# Altium schematic sheet Tiresias_misc.SchDoc: Tiresias Miscellaneous
size 393 x 281 mm; Author: João Victor Colombari Carlet; CompanyName: GMETA; DrawnBy: João Victor Colombari Carlet; Organization: R&D GMETA; Address1: EESC - USP; Address2: 400, Trabalhador São-Carlense Av.; Address3: 13566-590, São Carlos; Address4: São Paulo, Brazil; Revision: 0; SheetNumber: 5; SheetTotal: 5; Address_Website: http://www.sel.eesc.usp.br/jcarmo/metamaterials/
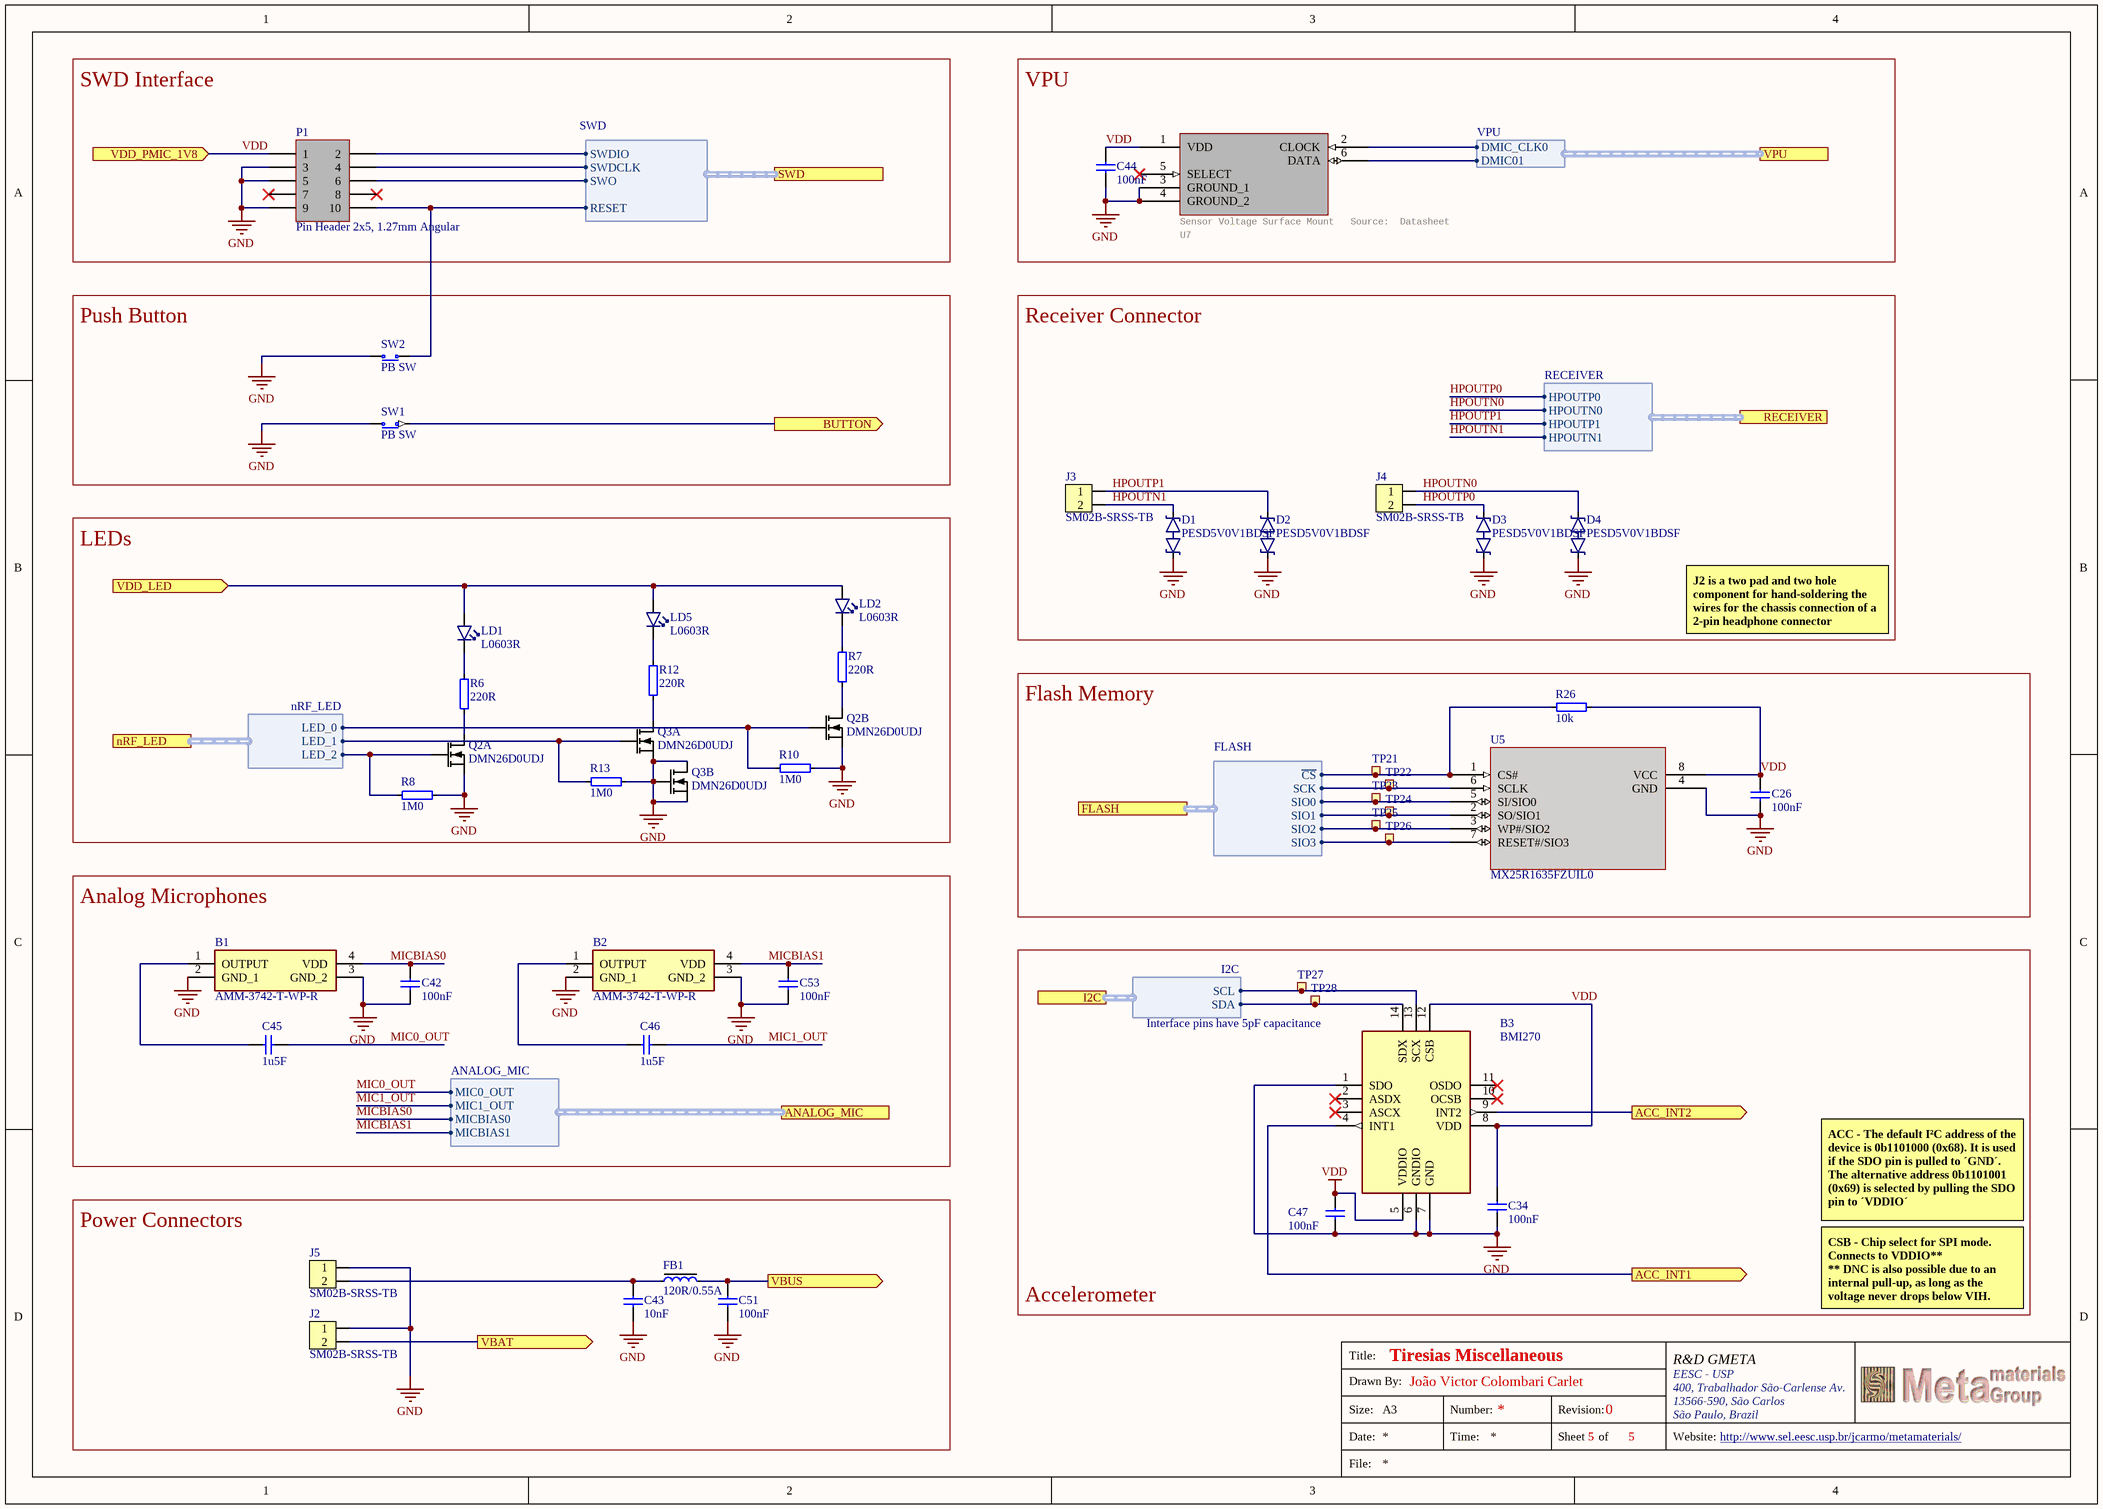
[diagram p0: Tiresias_misc.SchDoc]

## Parts
B1  AMM-3742-T-WP-R  [AMM3742TWPR]
B2  AMM-3742-T-WP-R  [AMM3742TWPR]
B3  BMI270  [BMI270]
C26  100nF  [CAPC0603X03L_C]
C34  100nF  [CAPC0603X03L_C]
C42  100nF  [CAPC0603X03L_C]
C43  10nF  [CAPC0603X03L_C]
C44  100nF  [CAPC0603X03L_C]
C45  1u5F  [CAPC1005X04L]
C46  1u5F  [CAPC1005X04L]
C47  100nF  [CAPC0603X03L_C]
C51  100nF  [CAPC0603X03L_C]
C53  100nF  [CAPC0603X03L_C]
D1  PESD5V0V1BDSF  [DFN40P60X30-2N]
D2  PESD5V0V1BDSF  [DFN40P60X30-2N]
D3  PESD5V0V1BDSF  [DFN40P60X30-2N]
D4  PESD5V0V1BDSF  [DFN40P60X30-2N]
FB1  120R/0.55A  [INDC1005X04L]
J2  SM02B-SRSS-TB  [SM02B-SRSS-TB(LF)(SN)]
J3  SM02B-SRSS-TB  [SM02B-SRSS-TB(LF)(SN)]
J4  SM02B-SRSS-TB  [SM02B-SRSS-TB(LF)(SN)]
J5  SM02B-SRSS-TB  [SM02B-SRSS-TB(LF)(SN)]
LD1  L0603R  [LED_0603_R]
LD2  L0603R  [LED_0603_R]
LD5  L0603R  [LED_0603_R]
P1  Pin Header 2x5, 1.27mm Angular  [HDR_2x5-SMD-1.27mm-ANG]
Q2  DMN26D0UDJ  [SOTFL35P100X50-6N]  (parts A,B of 2)
Q3  DMN26D0UDJ  [SOTFL35P100X50-6N]  (parts A,B of 2)
R6  220R  [RESC0603X03L_C]
R7  220R  [RESC0603X03L_C]
R8  1M0  [RESC0603X03L_C]
R10  1M0  [RESC0603X03L_C]
R12  220R  [RESC0603X03L_C]
R13  1M0  [RESC0603X03L_C]
R26  10k  [RESC0603X03L_C]
SW1  PB SW  [KLS-TS3401]
SW2  PB SW  [KLS-TS3401]
TP21  Ø1.0mm,SMD  [TP_SMD_D1.0mm]  (value not drawn)  (no BOM)
TP22  Ø1.0mm,SMD  [TP_SMD_D1.0mm]  (value not drawn)  (no BOM)
TP23  Ø1.0mm,SMD  [TP_SMD_D1.0mm]  (value not drawn)  (no BOM)
TP24  Ø1.0mm,SMD  [TP_SMD_D1.0mm]  (value not drawn)  (no BOM)
TP25  Ø1.0mm,SMD  [TP_SMD_D1.0mm]  (value not drawn)  (no BOM)
TP26  Ø1.0mm,SMD  [TP_SMD_D1.0mm]  (value not drawn)  (no BOM)
TP27  Ø1.0mm,SMD  [TP_SMD_D1.0mm]  (value not drawn)  (no BOM)
TP28  Ø1.0mm,SMD  [TP_SMD_D1.0mm]  (value not drawn)  (no BOM)
U5  MX25R1635FZUIL0  [USON-8L-2X3X0P6_MAC-L]
U7  Sensor Voltage Surface Mount   Source:  Datasheet  [V2S200D18]

## Blocks framed on the sheet
SWD Interface: P1
VPU: C44 U7
Push Button: SW1 SW2
Receiver Connector: D1-D4 J3 J4
LEDs: LD1 LD2 LD5 Q2 Q3 R6-R8 R10 R12 R13
Flash Memory: C26 R26 TP21-TP26 U5
Analog Microphones: B1 B2 C42 C45 C46 C53
Accelerometer: B3 C34 C47 TP27 TP28
Power Connectors: C43 C51 FB1 J2 J5

## Ports
ACC_INT1 (out, see Tiresias_Cover_letter[4C], Tiresias_MCU[4B]), ACC_INT2 (out, see Tiresias_Cover_letter[4C], Tiresias_MCU[4B]), ANALOG_MIC (harness ANALOG_MIC, see Tiresias_Cover_letter[4C], Tiresias_audio_codec[1D]), BUTTON (out, see Tiresias_Cover_letter[4C], Tiresias_MCU[4A]), FLASH (harness FLASH, see Tiresias_Cover_letter[4C], Tiresias_MCU[4C]), I2C (harness I2C, see Tiresias_Cover_letter[4C], Tiresias_audio_codec[3C], Tiresias_MCU[4C]), nRF_LED (harness nRF_LED, see Tiresias_Cover_letter[4C], Tiresias_MCU[4A]), RECEIVER (harness RECEIVER, see Tiresias_Cover_letter[4C], Tiresias_audio_codec[1D]), SWD (harness SWD, see Tiresias_Cover_letter[4C], Tiresias_MCU[4C]), VBAT (out, see Tiresias_Cover_letter[4B], Tiresias_PMIC[1A]), VBUS (out, see Tiresias_Cover_letter[4B], Tiresias_PMIC[1A]), VDD_LED (in, see Tiresias_Cover_letter[4B], Tiresias_PMIC[3A]), VDD_PMIC_1V8 (in, see Tiresias_Cover_letter[4B], Tiresias_MCU[1A]), VPU (harness VPU, see Tiresias_Cover_letter[4D], Tiresias_audio_codec[1C])

## Harnesses
FLASH: ~{CS}, SCK, SIO0, SIO1, SIO2, SIO3
SWD: SWDIO, SWDCLK, SWO, RESET
ANALOG_MIC: MIC0_OUT, MIC1_OUT, MICBIAS0, MICBIAS1
RECEIVER: HPOUTP0, HPOUTN0, HPOUTP1, HPOUTN1
nRF_LED: LED_0, LED_1, LED_2
I2C: SDA, SCL
VPU: DMIC01, DMIC_CLK0

## Nets
GND: B1.2(GND_1) B1.3(GND_2) B2.2(GND_1) B2.3(GND_2) B3.1(SDO) B3.6(GNDIO) B3.7(GND) C26.1 C34.1 C42.1 C43.1 C44.2 C47.1 C51.1 C53.1 D1.1 D2.1 D3.1 D4.1 J2.1 J5.1 P1.3 P1.5 P1.9 Q2.1(S1) Q2.4(S2) Q3.1(S1) Q3.3(D2) Q3.4(S2) Q3.5(G2) R8.1 R10.1 R13.1 SW1.2(COM) SW2.2(COM) U5.4(GND) U7.3(GROUND_1) U7.4(GROUND_2)
VDD: B3.5(VDDIO) B3.8(VDD) B3.12(CSB) C26.2 C34.2 C44.1 C47.2 P1.1 R26.1 U5.8(VCC) U7.1(VDD) ; port VDD_PMIC_1V8
ACC_INT1: B3.4(INT1) ; port ACC_INT1
ACC_INT2: B3.9(INT2) ; port ACC_INT2
BUTTON: SW1.1(N.O) ; port BUTTON
HPOUTN0: D4.2 J4.1 ; port RECEIVER.HPOUTN0
HPOUTN1: D1.2 J3.2 ; port RECEIVER.HPOUTN1
HPOUTP0: D3.2 J4.2 ; port RECEIVER.HPOUTP0
HPOUTP1: D2.2 J3.1 ; port RECEIVER.HPOUTP1
MIC0_OUT: C45.2 ; port ANALOG_MIC.MIC0_OUT
MIC1_OUT: C46.2 ; port ANALOG_MIC.MIC1_OUT
MICBIAS0: B1.4(VDD) C42.2 ; port ANALOG_MIC.MICBIAS0
MICBIAS1: B2.4(VDD) C53.2 ; port ANALOG_MIC.MICBIAS1
VBAT: J2.2 ; port VBAT
VBUS: C51.2 FB1.2 ; port VBUS
VDD_LED: LD1.2(A) LD2.2(A) LD5.2(A) ; port VDD_LED
NetB1_1: B1.1(OUTPUT) C45.1
NetB2_1: B2.1(OUTPUT) C46.1
NetB3_13: B3.13(SCX) TP27.1 ; port I2C.SCL
NetB3_14: B3.14(SDX) TP28.1 ; port I2C.SDA
NetC43_2: C43.2 FB1.1 J5.2
NetLD1_1: LD1.1(C) R6.2
NetLD2_1: LD2.1(C) R7.2
NetLD5_1: LD5.1(C) R12.2
NetP1_2: P1.2 ; port SWD.SWDIO
NetP1_4: P1.4 ; port SWD.SWDCLK
NetP1_6: P1.6 ; port SWD.SWO
NetP1_10: P1.10 SW2.1(N.O) ; port SWD.RESET
NetQ2_2: Q2.2(G1) R8.2 ; port nRF_LED.LED_2
NetQ2_3: Q2.3(D2) R7.1
NetQ2_5: Q2.5(G2) R10.2 ; port nRF_LED.LED_0
NetQ2_6: Q2.6(D1) R6.1
NetQ3_2: Q3.2(G1) R13.2 ; port nRF_LED.LED_1
NetQ3_6: Q3.6(D1) R12.1
NetR26_2: R26.2 TP21.1 U5.1(CS#) ; port FLASH.~{CS}
NetTP22_1: TP22.1 U5.6(SCLK) ; port FLASH.SCK
NetTP23_1: TP23.1 U5.5(SI/SIO0) ; port FLASH.SIO0
NetTP24_1: TP24.1 U5.2(SO/SIO1) ; port FLASH.SIO1
NetTP25_1: TP25.1 U5.3(WP#/SIO2) ; port FLASH.SIO2
NetTP26_1: TP26.1 U5.7(RESET#/SIO3) ; port FLASH.SIO3
NetU7_2: U7.2(CLOCK) ; port VPU.DMIC_CLK0
NetU7_6: U7.6(DATA) ; port VPU.DMIC01

Not connected (* = marked no-connect by the designer): B3 2(ASDX)* 3(ASCX)* 10(OCSB)* 11(OSDO)*; P1 7* 8*; U7 5(SELECT)*

## Notes on the sheet
- J2 is a two pad and two hole component for hand-soldering the wires for the chassis connection of a 2-pin headphone connector
- (near B3) Interface pins have 5pF capacitance
- ACC - The default I²C address of the device is 0b1101000 (0x68). It is used if the SDO pin is pulled to ´GND´. The alternative address 0b1101001 (0x69) is selected by pulling the SDO pin to ´VDDIO´
- CSB - Chip select for SPI mode.
  Connects to VDDIO**
  ** DNC is also possible due to an internal pull-up, as long as the voltage never drops below VIH.
- Title:
- Drawn By:
- Size:
- Date:
- File:
- A3
- Number:
- Time:
- Revision:
- Sheet
- of
- Website:

## Library data of the parts
B1 B2 = AMM-3742-T-WP-R: Microphones MICROPHONE -42 DB 2 VDC 200 UA 300 OHM,20 Hz ~ 20 kHz Analog Microphone MEMS (Silicon) 1.5 V ~ 3.6 V Omnidirectional (-42dB +/-1dB) Solder Pads; Manufacturer_Name: PUI Audio; Geometry.Height: 1.3mm; Mouser Part Number: 665-AMM-3742-T-WP-R; Mouser Price/Stock: https://www.mouser.co.uk/ProductDetail/PUI-Audio/AMM-3742-T-WP-R?qs=iLbezkQI%252Bsjj6DcgQwGq9A%3D%3D; Manufacturer_Part_Number: AMM-3742-T-WP-R; Datasheet Link: https://www.puiaudio.com/media/SpecSheet/AMM-3742-T-WP-R.pdf
B3 = BMI270: IMUs - Inertial Measurement Units Smart Ultra-Low Power Inertial Measurement Unit (IMU) for Wearable Applications; Manufacturer_Name: BOSCH; Geometry.Height: 0.87mm; Mouser Part Number: 262-BMI270; Mouser Price/Stock: https://www.mouser.co.uk/ProductDetail/Bosch-Sensortec/BMI270?qs=u16ybLDytRYIj%252BjQEee88A%3D%3D; Manufacturer_Part_Number: BMI270; Datasheet Link: https://www.bosch-sensortec.com/media/boschsensortec/downloads/datasheets/bst-bmi270-ds000.pdf
C26 C34 C42 C44 C47 C51 C53 = CAP_0201_100nF: Capacitor, NP0, ±2%; Part Number: C0201-100n; Class: SMT; Manufacturer: *; Manufacturer Part Number: *; LatestRevisionDate: 2024/02/20; Value: 100nF; Package: 0201; Pin Count: 2; JLCpcb link: *; Mouser link: *; DigiKey link: *
C43 = CAP_0201_10nF: Capacitor, NP0, ±2%; Part Number: C0201-100n; Class: SMT; Manufacturer: *; Manufacturer Part Number: *; LatestRevisionDate: 2024/02/20; Value: 10nF; Package: 0201; Pin Count: 2; JLCpcb link: *; Mouser link: *; DigiKey link: *
C45 C46 = CAP_0402_1u5F: Capacitor, X5R, ±5%; Part Number: C0402-1µ0; Class: SMT; Manufacturer: *; Manufacturer Part Number: *; LatestRevisionDate: 2024/02/20; Value: 1u5F; Package: 0402; Pin Count: 2
D1-D4 = PESD5V0V1BDSF: Very low capacitance bidirectional ESD protection diode; Manufacturer: Nexperia; Note: N.A.; Pad Count: 2; Part Number: PESD5V0V1BDSF; Manufacturer Part Number: PESD5V0V1BDSF; ComponentLink1URL: https://assets.nexperia.com/documents/data-sheet/PESD5V0V1BDSF.pdf; ComponentLink1Description: Datasheet; ComponentLink2URL: https://www.digikey.com/product-detail/en/nexperia-usa-inc/PESD5V0V1BDSF-315/1727-1320-1-ND/4386332; ComponentLink2Description: Supplier link; HelpURL: https://www.nexperia.com/products/esd-protection-tvs-filtering-and-signal-conditioning/esd-protection/general-purpose-esd-protection-devices/PESD5V0V1BDSF.html; Footprint Doc: DSN0603-2; LatestRevisionDate: 2020-08-23; Published: 2020-08-23; Value: PESD5V0V1BDSF; Supplier 1: Digi-Key; Supplier Part Number 1: 1727-1320-1-ND; Supplier 2: N.A.; Supplier Part Number 2: N.A.; Artikkelnr Noca: N.A.; Part number IPS: N.A.; Component Class: Semiconductors; PartId: 101300179; Author: rsk; Part number Norautron: N.A.
FB1 = FB0402-120R@100M-500mA: Ferrite Bead, 120 Ohm @ 100MHz, 500mA, 250 mOhm Max; Manufacturer: Murata; Manufacturer Part Number: BLM15AG121SN1D; Part number IPS: 00000009954; Part number Norautron: N.A.; Note: Chip EMIFIL Inductor Type Chip Ferrite Bead; Artikkelnr Noca: 33029317; Pad Count: 2; Part Number: FB0402-120R@100M-500mA; Footprint Doc: 0402; LatestRevisionDate: 2014-01-10; Published: 2011-11-14; Value: 120R/0.55A; ComponentLink1Description: Datasheet; ComponentLink2Description: Supplier link; ComponentLink1URL: N.A.; ComponentLink2URL: N.A.; HelpURL: http://search.murata.co.jp/Ceramy/image/img/PDF/ENG/L0110S0100BLM15A_SN.pdf; Supplier 1: Digi-Key; Supplier Part Number 1: 490-1005-1-ND; Supplier 2: Farnell; Supplier Part Number 2: 151-5760; Component Class: Inductors; PartId: 100300099; Author: rsk
J2-J5 = SM02B-SRSS-TB: 1.0mm pitch connector side entry SMD; Part Number: SM03B-SRSS-TB; Manufacturer: JST Sales America Inc.; Manufacturer Part Number: SM03B-SRSS-TB(LF)(SN); Part number IPS: 00000001785; Note: JST, Header; Artikkelnr Noca: N.A.; Pad Count: 3; Footprint Doc: SM03B-SRSS-TB; LatestRevisionDate: 2017-10-09; Published: 2017-10-09; Value: SM02B-SRSS-TB; ComponentLink1URL: N.A.; ComponentLink1Description: Datasheet; ComponentLink2URL: N.A.; ComponentLink2Description: Supplier link; HelpURL: http://www.jst-mfg.com/product/pdf/eng/eSH.pdf; Supplier 1: Cabcon; Supplier Part Number 1: SM03B-SRSS-TB(LF)(SN); Supplier 2: Digi-Key; Supplier Part Number 2: 455-1803-1-ND; Component Class: Connectors; PartId: 100500605; Author: rsk; Part number Norautron: N.A.
LD1 LD2 LD5 = LED_0603_RED: LED, SMD, 0603, RED; Part Number: OVS-0608 RED; Manufacturer: Multicomp; Pad Count: 2; Note: 100 mcd @ 20 mA, Super bright; Artikkelnr Noca: N.A.; Footprint Doc: 0603; Value: L0603R; Component Class: Optoelectronics; Author: rsk; PartId: 101400024; Manufacturer Part Number: OVS-0608; ComponentLink1URL: N.A.; ComponentLink1Description: Datasheet; ComponentLink2URL: N.A.; ComponentLink2Description: Supplier link; HelpURL: http://www.farnell.com/datasheets/1673654.pdf; LatestRevisionDate: 2011-10-28; Published: 2011-10-28; Supplier 1: Farnell; Supplier Part Number 1: 171-6774; Supplier 2: N.A.; Supplier Part Number 2: N.A.; Part number IPS: N.A.; Part number Norautron: N.A.
P1 = Pin Header 2x5 SMD, 1.27mm, ANG: Pin Header 2x5, 1.27mm (50mil), SMD, Keying Shroud Angular; Part Number: Pin Header 2x5 SMD, 1.27mm, KS; Manufacturer: W-CON; Manufacturer Part Number: 3132-10MS0BK00R1; Part number IPS: 00000009968; Note: N.A.; Artikkelnr Noca: 55010009; Pad Count: 10; Footprint Doc: HDR_2x5-SMD-1.27mm; LatestRevisionDate: 2016-04-21; Pin Count: 10; Publisher: Nordic Semiconductor; Published: 2016-01-22; Value: Pin Header 2x5, 1.27mm Angular; ComponentLink1URL: N.A.; ComponentLink1Description: Datasheet; ComponentLink2URL: N.A.; ComponentLink2Description: Supplier link; HelpURL: \\hizz\pro\app9717\Datasheet\connectors\W-CON\3132-XXMXXBK00XX.pdf; Supplier 1: Cabcon; Supplier Part Number 1: 3132-10MS0BK00R1; Supplier 2: Samtec; Supplier Part Number 2: FTSH-105-01-F-DV-K; Component Class: Connectors; PartId: 100500261
Q2 Q3 = DMN26D0UDJ-7: MOSFET, Dual N-Channel, 20V, 240mA, 1050mOhm, 300mW; Manufacturer: Diodes Incorporated; Note: N.A.; Pad Count: 6; Part Number: DMN26D0UDJ-7; Manufacturer Part Number: DMN26D0UDJ-7; LatestRevisionDate: 2021-06-03; Published: 2021-06-03; Value: DMN26D0UDJ; Artikkelnr Noca: N.A.; Footprint Doc: SOT-963; Part number IPS: N.A.; ComponentLink1URL: https://www.diodes.com/assets/Datasheets/ds31481.pdf; ComponentLink1Description: Datasheet; ComponentLink2URL: https://www.digikey.com/en/products/detail/diodes-incorporated/DMN26D0UDJ-7/2346781; ComponentLink2Description: Supplier link; HelpURL: https://www.diodes.com/part/view/DMN26D0UDJ; Supplier 1: Digi-Key; Supplier Part Number 1: DMN26D0UDJ-7DICT-ND; Supplier 2: N.A.; Supplier Part Number 2: N.A.; Component Class: Semiconductors; PartId: 101300183; Author: rubr; Part number Norautron: N.A.
R6 R7 R12 = RES_0201_220R: Resistor, ±1%, 0.05W; Part Number: R0201-220; Manufacturer: N.A.; Part number IPS: 00000000863; Pad Count: 2; Note: Chip Res 1%; Footprint Doc: 0201; Value: 220R; Component Class: Resistors; Author: rsk; PartId: 100100032; Manufacturer Part Number: N.A.; ComponentLink1URL: N.A.; ComponentLink1Description: Datasheet; ComponentLink2URL: N.A.; ComponentLink2Description: Supplier link; HelpURL: N.A.; LatestRevisionDate: 2014-11-13; Published: 2014-11-13; Supplier 1: N.A.; Supplier Part Number 1: N.A.; Supplier 2: N.A.; Supplier Part Number 2: N.A.; Artikkelnr Noca: N.A.; Part number Norautron: N.A.
R8 R10 R13 = RES_0201_1M0: Resistor, ±1%, 0.05W; Part Number: R0201-100k; Manufacturer: N.A.; Class: SMT; Latest Revision Date: 2024-04-23; ComponentLink1URL: N.A.; ComponentLink1Description: Datasheet; ComponentLink2URL: N.A.; ComponentLink2Description: Supplier link; Value: 1M0; Package: 0201; Pin Count: 2; JLCpcb link: Chip Res 1%; Mouser link: N.A.; DigiKey link: 00000001419; Author: rsk
R26 = RES_0201_10K: Resistor, ±1%, 0.05W; Part Number: R0201-100k; Manufacturer: N.A.; Class: SMT; Latest Revision Date: 2024-04-23; ComponentLink1URL: N.A.; ComponentLink1Description: Datasheet; ComponentLink2URL: N.A.; ComponentLink2Description: Supplier link; Value: 10k; Package: 0201; Pin Count: 2; JLCpcb link: Chip Res 1%; Mouser link: N.A.; DigiKey link: 00000001419; Author: rsk
SW1 SW2 = KLS7-TS3401-2.5-160R: Tactile Switch, SPNO, SMD, 160gf, 4.2x3.3x2.5mm; Manufacturer: KLS; Note: N.A.; Pad Count: 4; Part Number: KLS7-TS3401-2.5-160R; Manufacturer Part Number: KLS7-TS3401-2.5-160R; Footprint Doc: KLS-TS3401; LatestRevisionDate: 2021-09-22; Published: 2021-09-22; Value: PB SW; Artikkelnr Noca: N.A.; Part number IPS: N.A.; ComponentLink1URL: \\hizz\pro\app9717\Datasheet\switches\KLS\L-KLS7-TS3401-2.5-160-T-B.pdf; ComponentLink1Description: Datasheet; ComponentLink2URL: N.A.; ComponentLink2Description: Supplier link; HelpURL: N.A.; Supplier 1: Cabcon; Supplier Part Number 1: KLS7-TS3401-2.5-160R; Supplier 2: N.A.; Supplier Part Number 2: N.A.; Component Class: Switches; Author: rubr; Part number Norautron: N.A.
TP21-TP28 = TP_SMD_Ø1.0MM: 1.0mm circular SMD testpad; Manufacturer: Nordic Semiconductor; Manufacturer Part Number: N.A.; Pad Count: 1; Part Number: TP_SMD_Ø1.0MM; ComponentLink1URL: N.A.; ComponentLink1Description: Datasheet; ComponentLink2URL: N.A.; ComponentLink2Description: Supplier link; HelpURL: N.A.; Footprint Doc: TP_SMD_Ø1.0mm; LatestRevisionDate: 2021-03-05; Published: 2013-06-11; Value: Ø1.0mm,SMD; Note: N.A.; Supplier 1: N.A.; Supplier Part Number 1: N.A.; Supplier 2: N.A.; Supplier Part Number 2: N.A.; Artikkelnr Noca: N.A.; Part number IPS: N.A.; Component Class: Connectors; PartId: 100500475; Author: rsk; Part number Norautron: N.A.
U5 = MX25R1635FZUIL0: Wide Vcc Range 16M-BIT [x 1/x 2/x 4] CMOS MXSMIO (SERIAL MULTI I/O) FLASH MEMORY; Mfr_Name: Macronix; RefDes: RefDes; Type: Type
U7 = V2S200D-1-8: Manufacturer_Name: Knowles; GateName_1: G$1; Part Number: V2S200D-1-8; LibraryName: V2S200D-1-8; DeviceSetName: V2S200D-1-8; Package: V2S200D18; Mouser_Part_Number: 721-V2S200D-1-8; Mouser_Price-Stock: https://www.mouser.co.uk/ProductDetail/Knowles/V2S200D-1-8?qs=ulEaXIWI0c83wNc0KwH8Ig%3D%3D; Manufacturer_Part_Number: V2S200D-1-8; Height: 1.03mm